# EAGLE schematic lcd (EAGLE 9.1.1)
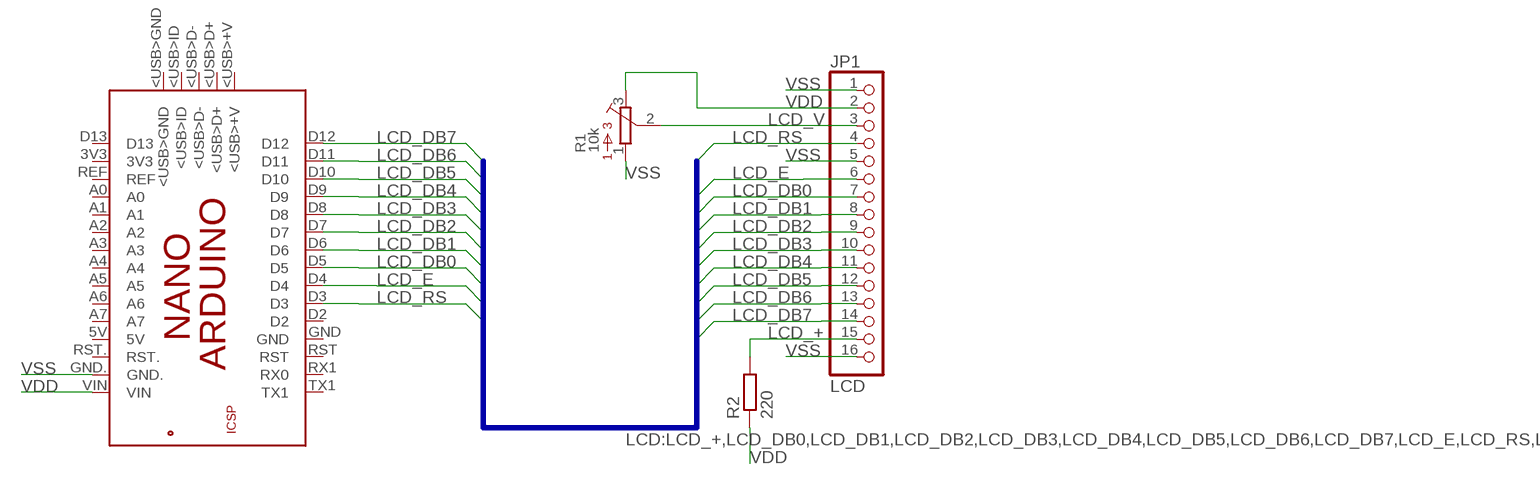
[diagram p0: schematic, sheet 1]

## Parts
JP1  LCD  PINHD-1X16  [1X16]
PCB1  ARDUINO_NANO  [ARDUINO_NANO]
R1  10k  3362H  [3362H]
R2  220  R-EU_0204/7  [0204/7]

## Nets
LCD_+: JP1.15 R2.2
LCD_DB0: JP1.7 PCB1.D5
LCD_DB1: JP1.8 PCB1.D6
LCD_DB2: JP1.9 PCB1.D7
LCD_DB3: JP1.10 PCB1.D8
LCD_DB4: JP1.11 PCB1.D9
LCD_DB5: JP1.12 PCB1.D10
LCD_DB6: JP1.13 PCB1.D11
LCD_DB7: JP1.14 PCB1.D12
LCD_E: JP1.6 PCB1.D4
LCD_RS: JP1.4 PCB1.D3
LCD_V: JP1.3 R1.2
VDD: JP1.2 PCB1.VIN R1.3 R2.1
VSS: JP1.1 JP1.5 JP1.16 PCB1.GND. R1.1
Unconnected: PCB1.3V3 PCB1.5V PCB1.5V. PCB1.<USB>+V PCB1.<USB>D+ PCB1.<USB>D- PCB1.<USB>GND PCB1.<USB>ID PCB1.A0 PCB1.A1 PCB1.A2 PCB1.A3 PCB1.A4 PCB1.A5 PCB1.A6 PCB1.A7 PCB1.D2 PCB1.D13 PCB1.GND PCB1.GND_ PCB1.MISO PCB1.MOSI PCB1.REF PCB1.RESET.. PCB1.RST PCB1.RST. PCB1.RX1(RX0) PCB1.SCK PCB1.TX1

## Buses
LCD:LCD_+,LCD_DB0,LCD_DB1,LCD_DB2,LCD_DB3,LCD_DB4,LCD_DB5,LCD_DB6,LCD_DB7,LCD_E,LCD_RS,LCD_V

## Library data of the parts
JP1 = pinhead:PINHD-1X16: PIN HEADER
PCB1 = E14_Arduino_revC:ARDUINO_NANO: Device for representing an Arduino Nano board with a footprint in an EAGLE design. Created by Dave Young for Element14. More EAGLE documentation at: http://www.element14.com/community/community/knode/cadsoft_eagle
R1 = bourns:3362: 3362 Series 1/4" Square Trimmer
R2 = resistor:R-EU_: RESISTOR, European symbol